# Altium schematic sheet amplificadorAudio.SchDoc: CONTROLADORA AIRPOPCORN
size A3; DocumentNumber: 7; SheetNumber: 7; SheetTotal: 15
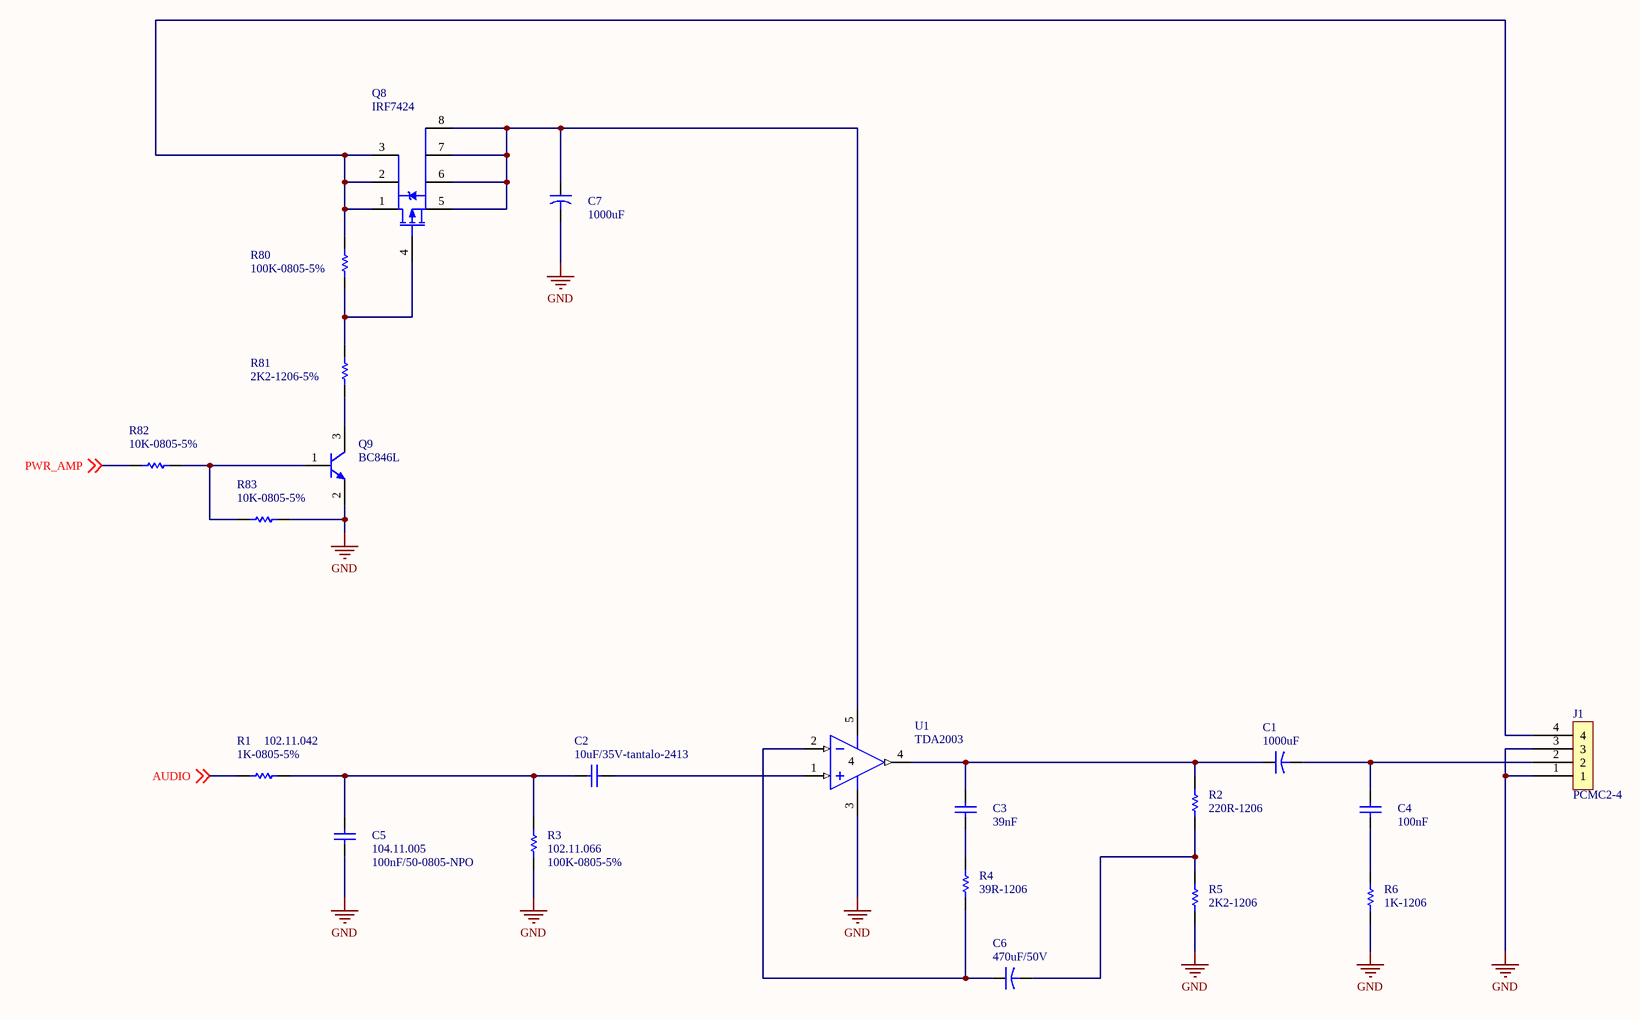
[diagram p0: amplificadorAudio.SchDoc]

## Parts
C1  1000uF  [CAP 10X5]
C2  10uF/35V-tantalo-2413  [CAP POL 5x11mm]
C3  39nF  [1206-REVISADO ONDA]
C4  100nF  [1206-REVISADO ONDA]
C5  100nF/50-0805-NPO  ERP: 104.11.005  [0805-REVISADO ONDA]
C6  470uF/50V  [CAP 10X5]
C7  1000uF  [CAP 10X5]
J1  PCMC2-4  [PCMC2-4]
Q8  IRF7424  [SOIC-08]
Q9  BC846L  [SOT23 - REVISADO ONDA]
R1  1K-0805-5%  ERP: 102.11.042  [0805-REVISADO ONDA]
R2  220R-1206  [1206-REVISADO ONDA]
R3  100K-0805-5%  ERP: 102.11.066  [0805-REVISADO ONDA]
R4  39R-1206  [1206-REVISADO ONDA]
R5  2K2-1206  [1206-REVISADO ONDA]
R6  1K-1206  [1206-REVISADO ONDA]
R80  100K-0805-5%  [0805-REVISADO ONDA]
R81  2K2-1206-5%  [1206-REVISADO ONDA]
R82  10K-0805-5%  [0805-REVISADO ONDA]
R83  10K-0805-5%  [0805-REVISADO ONDA]
U1  TDA2003  [PENTAWATT V]

## Nets
GND: C5.1 C7.2 J1.1 J1.3 Q9.2(E) R3.1 R5.2 R6.2 R83.2 U1.3(GND)
AUDIO: R1.1 ; off-sheet AUDIO
PWR_AMP: R82.1 ; off-sheet PWR_AMP
NetC1_1: C1.1 C3.2 R2.1 U1.4(OUT)
NetC1_2: C1.2 C4.2 J1.2
NetC2_1: C2.1 C5.2 R1.2 R3.2
NetC2_2: C2.2 U1.1(IN+)
NetC3_1: C3.1 R4.1
NetC4_1: C4.1 R6.1
NetC6_1: C6.1 R4.2 U1.2(IN-)
NetC6_2: C6.2 R2.2 R5.1
NetC7_1: C7.1 Q8.5(D2) Q8.6(D2) Q8.7(D2) Q8.8(D2) U1.5(V+)
NetJ1_4: J1.4 Q8.1(S2) Q8.2(S2) Q8.3(S2) R80.2
NetQ8_4: Q8.4(G2) R80.1 R81.2
NetQ9_1: Q9.1(B) R82.2 R83.1
NetQ9_3: Q9.3(C) R81.1

## Notes on the sheet
- NOME
- DATA
- PROJETO
- DESCRIÇÃO
- desenho
- verif.
- aprov.
- TAMANHO
- CODIGO
- Todas as informações disponíveis
- não devem ser divulgadas,
- em parte ou todo.
- CIRCUITO IMPRESSO
- MONTAGEM ELETRÔNICA
- A4
- de

## Library data of the parts
C1 C7 = 470uF/50V: ERP: 105.01.005
C3 C4 = 100nF/50-0805-NPO: ERP: 104.11.005
Q9 = BC846: ERP: 106.22.001
R2 R4-R6 = 390R-2512-5%: ERP: 102.31.002
C6 = 470uF/50V: ERP: 105.01.005
Q8 = IRF7424: ERP: 107.01.012
R3 R80 = 100K-0805-5%
  R80: ERP: 102.11.066
R82 R83 = 10K-0805-5%: ERP: 102.11.054